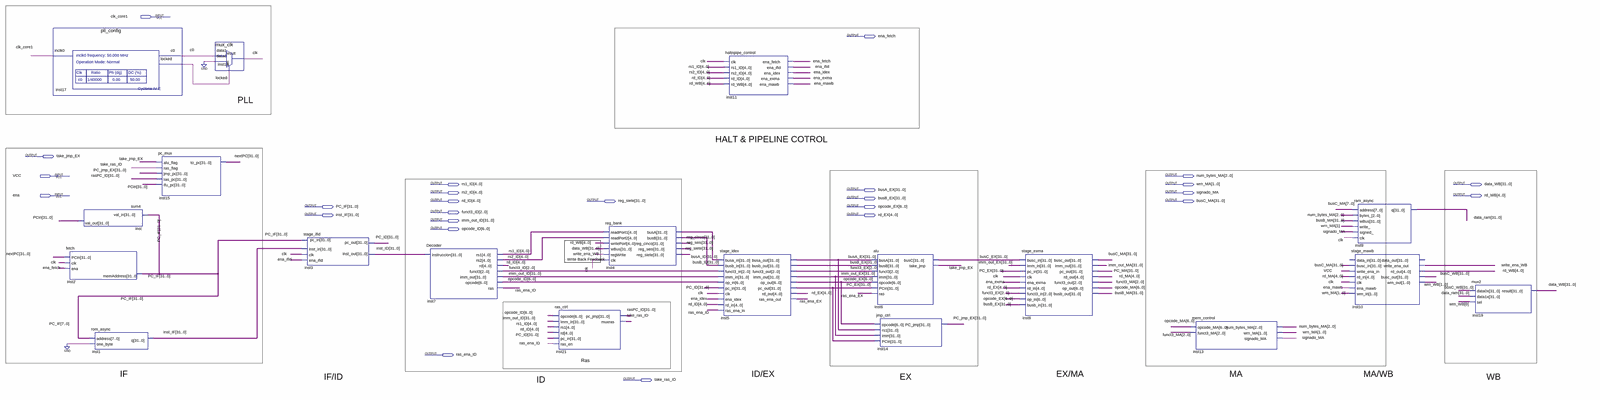
[diagram p0: schematic sheet, whole]
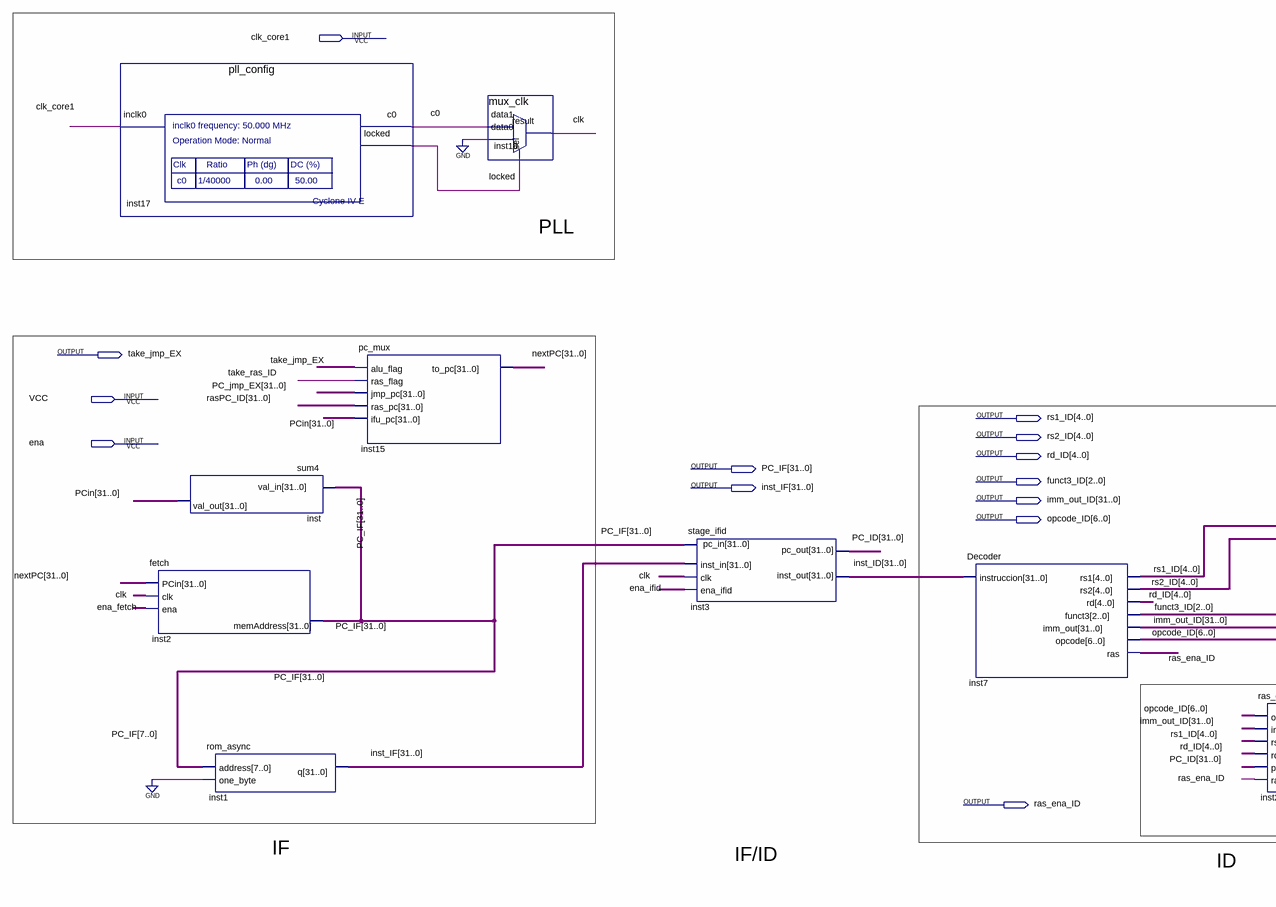
[diagram p1: schematic sheet, left part]
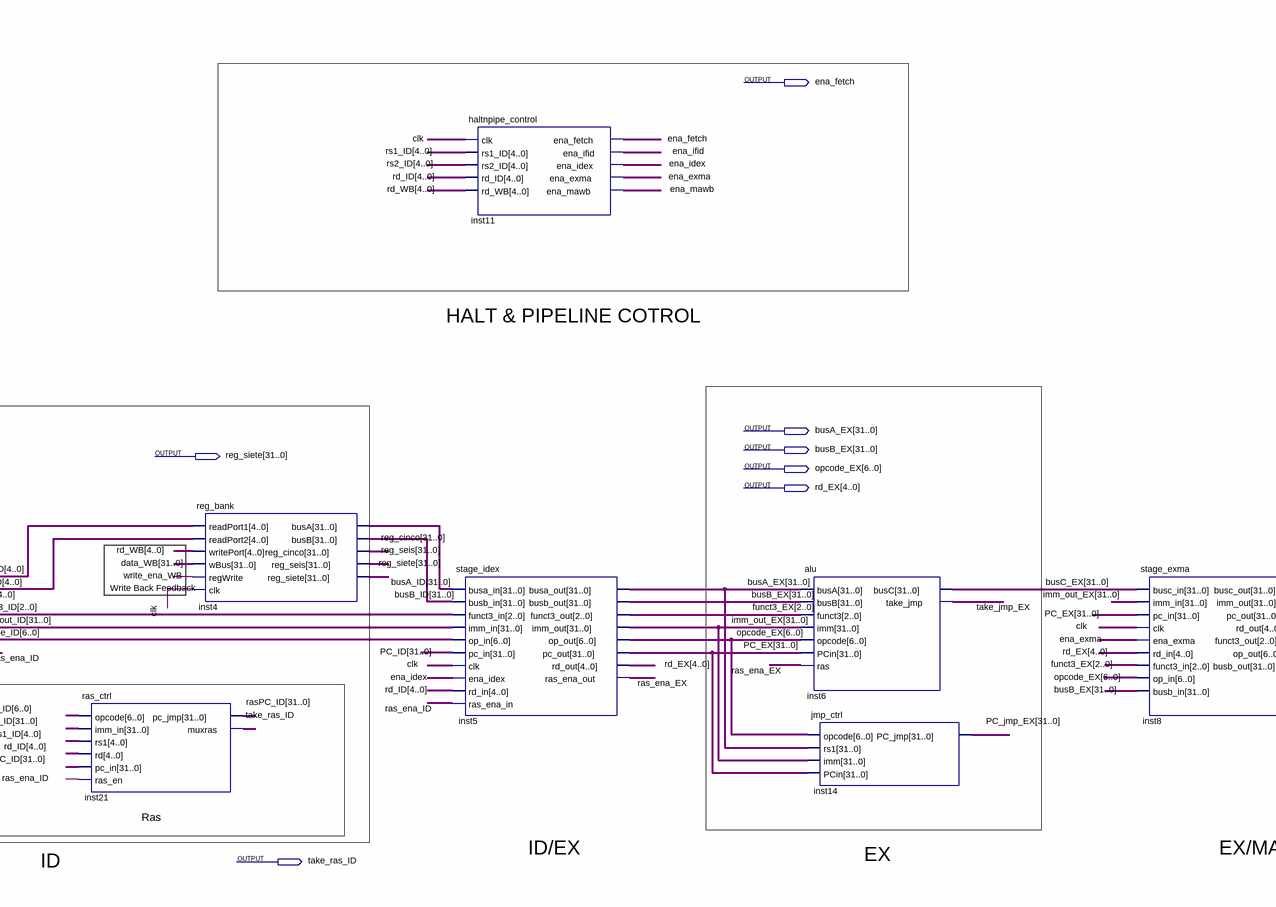
[diagram p2: schematic sheet, centre part]
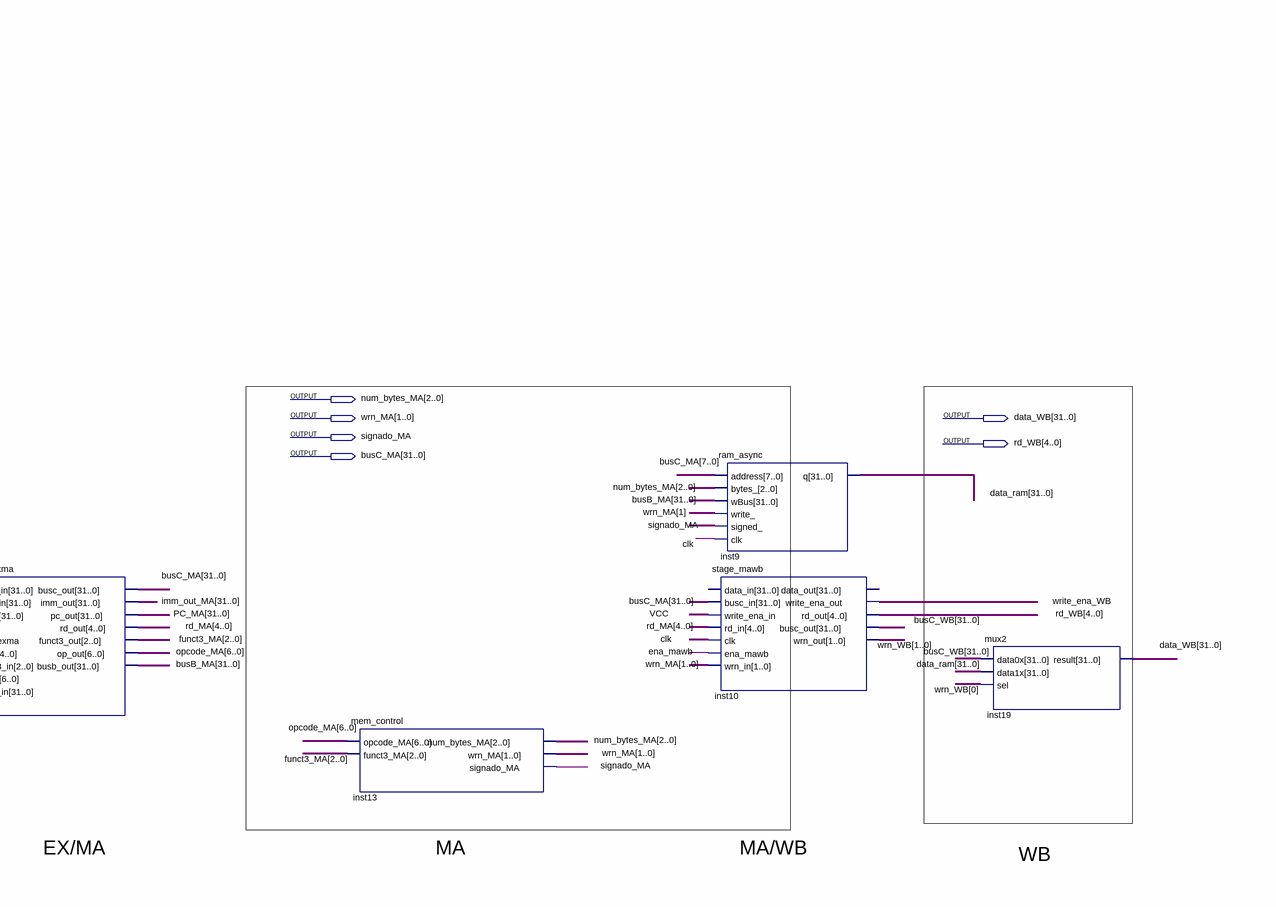
[diagram p3: schematic sheet, right part]
// Quartus schematic tpriscv_g4.bdf as structural Verilog: 19 symbols, 26 pins
module tpriscv_g4 (
  input  clk_core1,
  input  VCC,
  input  ena,
  output ena_fetch,
  output take_jmp_EX,
  output [2:0] num_bytes_MA,
  output [4:0] rs1_ID,
  output [1:0] wrn_MA,
  output [31:0] data_WB,
  output [31:0] busA_EX,
  output [4:0] rs2_ID,
  output signado_MA,
  output [4:0] rd_WB,
  output [31:0] busB_EX,
  output [4:0] rd_ID,
  output [31:0] reg_siete,
  output [31:0] busC_MA,
  output [31:0] PC_IF,
  output [6:0] opcode_EX,
  output [2:0] funct3_ID,
  output [31:0] inst_IF,
  output [4:0] rd_EX,
  output [31:0] imm_out_ID,
  output [6:0] opcode_ID,
  output ras_ena_ID,
  output take_ras_ID
);

  wire c0, clk, ena_exma, ena_idex, ena_ifid, ena_mawb, locked, ras_ena_EX, write_ena_WB;
  wire [1:0] wrn_WB;
  wire [2:0] funct3_EX, funct3_MA;
  wire [4:0] rd_MA;
  wire [6:0] opcode_MA;
  wire [31:0] busA_ID, busB_ID, busB_MA, busC_EX, busC_WB, data_ram, imm_out_EX, imm_out_MA, inst_ID, nextPC,
       PC_EX, PC_ID, PC_jmp_EX, PC_MA, PCin, rasPC_ID, reg_cinco, reg_seis;

  pll_config inst17 (.inclk0(clk_core1), .c0(c0), .locked(locked));
  fetch inst2 (.PCin(nextPC), .clk(clk), .ena(ena_fetch), .memAddress(PC_IF));
  sum4 inst (.val_in(PC_IF), .val_out(PCin));
  rom_async inst1 (.address(PC_IF[7:0]), .one_byte(1'b0), .q(inst_IF));
  pc_mux inst15 (
    .alu_flag(take_jmp_EX), .ras_flag(take_ras_ID), .jmp_pc(PC_jmp_EX), .ras_pc(rasPC_ID), .ifu_pc(PCin),
    .to_pc(nextPC));
  mux_clk inst18 (.data1(c0), .data0(1'b0), .sel(locked), .result(clk));
  stage_ifid inst3 (
    .inst_in(inst_IF), .pc_in(PC_IF), .clk(clk), .ena_ifid(ena_ifid), .inst_out(inst_ID), .pc_out(PC_ID));
  Decoder inst7 (
    .instruccion(inst_ID), .rs1(rs1_ID), .rs2(rs2_ID), .rd(rd_ID), .funct3(funct3_ID), .imm_out(imm_out_ID),
    .opcode(opcode_ID), .ras(ras_ena_ID));
  ras_ctrl inst21 (
    .opcode(opcode_ID), .imm_in(imm_out_ID), .rs1(rs1_ID), .rd(rd_ID), .pc_in(PC_ID), .ras_en(ras_ena_ID),
    .pc_jmp(rasPC_ID), .muxras(take_ras_ID));
  reg_bank inst4 (
    .readPort1(rs1_ID), .readPort2(rs2_ID), .writePort(rd_WB), .wBus(data_WB), .regWrite(write_ena_WB),
    .clk(clk), .busA(busA_ID), .busB(busB_ID), .reg_cinco(reg_cinco), .reg_seis(reg_seis),
    .reg_siete(reg_siete));
  stage_idex inst5 (
    .busa_in(busA_ID), .busb_in(busB_ID), .funct3_in(funct3_ID), .imm_in(imm_out_ID), .op_in(opcode_ID),
    .pc_in(PC_ID), .clk(clk), .ena_idex(ena_idex), .rd_in(rd_ID), .ras_ena_in(ras_ena_ID),
    .busa_out(busA_EX), .busb_out(busB_EX), .funct3_out(funct3_EX), .imm_out(imm_out_EX), .op_out(opcode_EX),
    .pc_out(PC_EX), .rd_out(rd_EX), .ras_ena_out(ras_ena_EX));
  haltnpipe_control inst11 (
    .clk(clk), .rs1_ID(rs1_ID), .rs2_ID(rs2_ID), .rd_ID(rd_ID), .rd_WB(rd_WB), .ena_fetch(ena_fetch),
    .ena_ifid(ena_ifid), .ena_idex(ena_idex), .ena_exma(ena_exma), .ena_mawb(ena_mawb));
  alu inst6 (
    .busA(busA_EX), .busB(busB_EX), .funct3(funct3_EX), .imm(imm_out_EX), .opcode(opcode_EX), .PCin(PC_EX),
    .ras(ras_ena_EX), .busC(busC_EX), .take_jmp(take_jmp_EX));
  jmp_ctrl inst14 (.opcode(opcode_EX), .rs1(busA_EX), .imm(imm_out_EX), .PCin(PC_EX), .PC_jmp(PC_jmp_EX));
  stage_exma inst8 (
    .busc_in(busC_EX), .imm_in(imm_out_EX), .pc_in(PC_EX), .clk(clk), .ena_exma(ena_exma), .rd_in(rd_EX),
    .funct3_in(funct3_EX), .op_in(opcode_EX), .busb_in(busB_EX), .busc_out(busC_MA), .imm_out(imm_out_MA),
    .pc_out(PC_MA), .rd_out(rd_MA), .funct3_out(funct3_MA), .op_out(opcode_MA), .busb_out(busB_MA));
  mem_control inst13 (
    .opcode_MA(opcode_MA), .funct3_MA(funct3_MA), .num_bytes_MA(num_bytes_MA), .wrn_MA(wrn_MA),
    .signado_MA(signado_MA));
  ram_async inst9 (
    .address(busC_MA[7:0]), .bytes_(num_bytes_MA), .wBus(busB_MA), .write_(wrn_MA[1]), .signed_(signado_MA),
    .clk(clk), .q(data_ram));
  stage_mawb inst10 (
    .busc_in(busC_MA), .write_ena_in(VCC), .rd_in(rd_MA), .clk(clk), .ena_mawb(ena_mawb), .wrn_in(wrn_MA),
    .write_ena_out(write_ena_WB), .rd_out(rd_WB), .busc_out(busC_WB), .wrn_out(wrn_WB));  // open: data_in, data_out
  mux2 inst19 (.data0x(busC_WB), .data1x(data_ram), .sel(wrn_WB[0]), .result(data_WB));

  // Notes on the sheet:
  //   PLL
  //   HALT & PIPELINE COTROL
  //   Write Back Feedback
  //   Ras
  //   IF
  //   ID/EX
  //   EX/MA
  //   MA
  //   MA/WB
  //   IF/ID
  //   EX
  //   WB
  //   ID
endmodule
